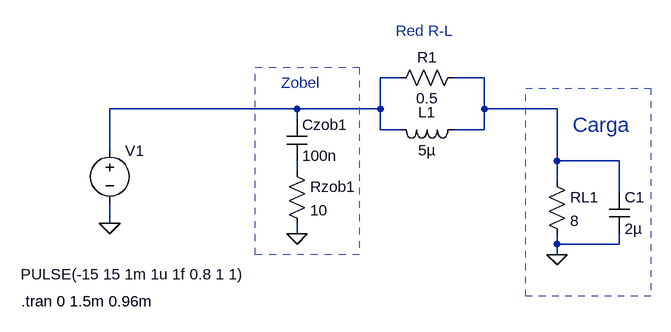
[diagram p0: schematic zobel-test.asc]
zobel-test.asc, the LTspice schematic file:
Version 4
SHEET 1 880 680
WIRE 96 -128 64 -128
WIRE 224 -128 176 -128
WIRE -64 -80 -352 -80
WIRE 64 -80 64 -128
WIRE 64 -80 -64 -80
WIRE 224 -80 224 -128
WIRE 336 -80 224 -80
WIRE -64 -64 -64 -80
WIRE 64 -48 64 -80
WIRE 96 -48 64 -48
WIRE 224 -48 224 -80
WIRE 224 -48 176 -48
WIRE -352 -16 -352 -80
WIRE 336 0 336 -80
WIRE 432 0 336 0
WIRE -64 16 -64 0
WIRE 336 32 336 0
WIRE 432 48 432 0
WIRE -352 96 -352 64
WIRE -64 112 -64 96
WIRE 336 128 336 112
WIRE 432 128 432 112
WIRE 432 128 336 128
WIRE 336 144 336 128
FLAG 336 144 0
FLAG -64 112 0
FLAG -352 96 0
SYMBOL res 320 16 R0
SYMATTR InstName RL1
SYMATTR Value 8
SYMBOL res -80 0 R0
SYMATTR InstName Rzob1
SYMATTR Value 10
SYMBOL cap -80 -64 R0
SYMATTR InstName Czob1
SYMATTR Value 100n
SYMBOL res 192 -144 R90
WINDOW 0 0 56 VBottom 2
WINDOW 3 32 56 VTop 2
SYMATTR InstName R1
SYMATTR Value 0.5
SYMBOL ind 192 -64 R90
WINDOW 0 5 56 VBottom 2
WINDOW 3 32 56 VTop 2
SYMATTR InstName L1
SYMATTR Value 5µ
SYMBOL voltage -352 -32 R0
WINDOW 3 -137 206 Left 2
WINDOW 123 0 0 Left 2
WINDOW 39 0 0 Left 2
SYMATTR Value PULSE(-15 15 1m 1u 1f 0.8 1 1)
SYMATTR InstName V1
SYMBOL cap 416 48 R0
SYMATTR InstName C1
SYMATTR Value 2µ
TEXT 360 -56 Left 3 ;Carga
TEXT -88 -120 Left 2 ;Zobel
TEXT -488 216 Left 2 !.tran 0 1.5m 0.96m
TEXT 88 -200 Left 2 ;Red R-L
RECTANGLE Normal 32 144 -128 -144 2
RECTANGLE Normal 480 208 288 -112 2

The netlist it stands for:
* zobel-test.asc
RL1 N002 0 8
Rzob1 N003 0 10
Czob1 N001 N003 100n
R1 N002 N001 0.5
L1 N002 N001 5µ
V1 N001 0 PULSE(-15 15 1m 1u 1f 0.8 1 1)
C1 N002 0 2µ
* Carga
* Zobel
.tran 0 1.5m 0.96m
* Red R-L
.backanno
.end